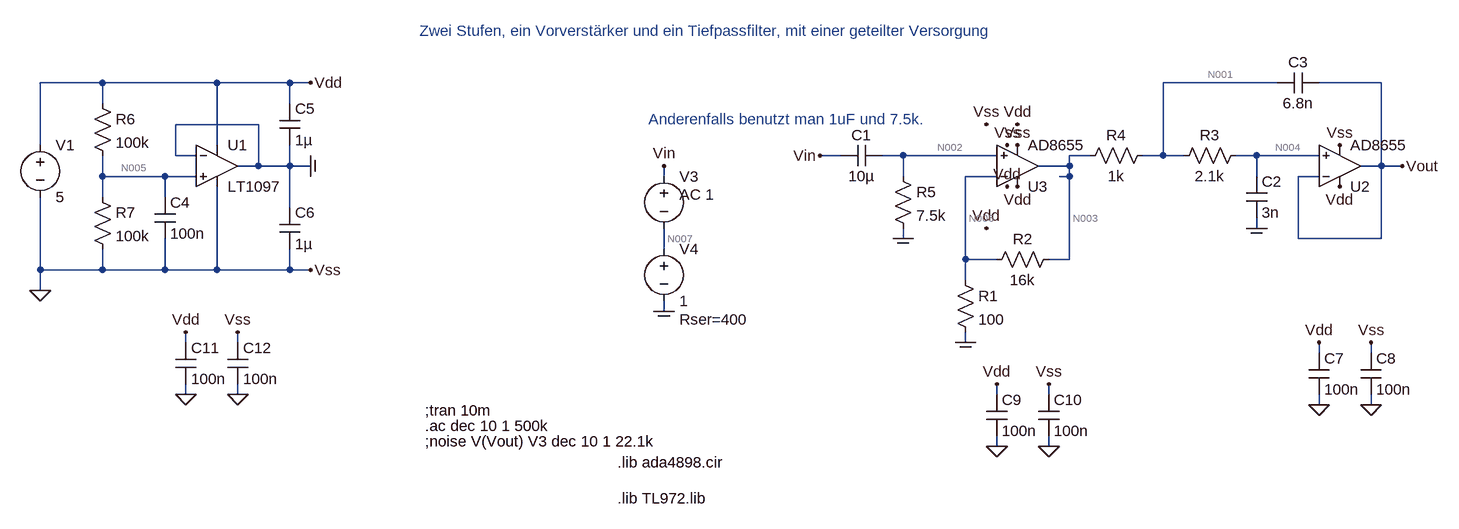
[diagram p0: schematic zwei_stufen_zweifachversorgung.asc]
zwei_stufen_zweifachversorgung.asc, the LTspice schematic file:
Version 4
SHEET 1 1124 5076
WIRE -1088 -64 -1184 -64
WIRE -912 -64 -1088 -64
WIRE -800 -64 -912 -64
WIRE -768 -64 -800 -64
WIRE 720 -64 544 -64
WIRE 880 -64 784 -64
WIRE -1088 -32 -1088 -64
WIRE -800 -32 -800 -64
WIRE -848 0 -976 0
WIRE -1184 32 -1184 -64
WIRE -912 32 -912 -64
WIRE -976 48 -976 0
WIRE -944 48 -976 48
WIRE 48 48 16 48
WIRE 144 48 112 48
WIRE 288 48 144 48
WIRE 432 48 400 48
WIRE 544 48 544 -64
WIRE 544 48 512 48
WIRE 576 48 544 48
WIRE 688 48 656 48
WIRE 784 48 688 48
WIRE -848 64 -848 0
WIRE -848 64 -880 64
WIRE -800 64 -800 32
WIRE -800 64 -848 64
WIRE -768 64 -800 64
WIRE 400 64 400 48
WIRE 400 64 352 64
WIRE 880 64 880 -64
WIRE 880 64 848 64
WIRE 912 64 880 64
WIRE -1088 80 -1088 48
WIRE -992 80 -1088 80
WIRE -944 80 -992 80
WIRE -224 80 -224 64
WIRE 144 80 144 48
WIRE 288 80 240 80
WIRE 400 80 400 64
WIRE 400 80 384 80
WIRE 688 80 688 48
WIRE 784 80 752 80
WIRE -1088 112 -1088 80
WIRE -992 112 -992 80
WIRE -800 128 -800 64
WIRE 688 160 688 144
WIRE 144 176 144 160
WIRE 752 176 752 80
WIRE 880 176 880 64
WIRE 880 176 752 176
WIRE -224 192 -224 160
WIRE 240 208 240 80
WIRE 288 208 240 208
WIRE 400 208 400 80
WIRE 400 208 368 208
WIRE -1184 224 -1184 112
WIRE -1088 224 -1088 192
WIRE -1088 224 -1184 224
WIRE -992 224 -992 176
WIRE -992 224 -1088 224
WIRE -912 224 -912 96
WIRE -912 224 -992 224
WIRE -800 224 -800 192
WIRE -800 224 -912 224
WIRE -768 224 -800 224
WIRE 240 240 240 208
WIRE -1184 256 -1184 224
WIRE -224 288 -224 272
WIRE -960 336 -960 320
WIRE -880 336 -880 320
WIRE 240 336 240 320
WIRE 784 352 784 336
WIRE 864 352 864 336
WIRE -960 416 -960 400
WIRE -880 416 -880 400
WIRE 288 416 288 400
WIRE 368 416 368 400
WIRE 784 432 784 416
WIRE 864 432 864 416
WIRE 288 496 288 480
WIRE 368 496 368 480
FLAG -768 -64 Vdd
FLAG 320 96 Vdd
FLAG 320 32 Vss
FLAG 240 336 COM
FLAG -224 288 COM
FLAG 16 48 Vin
FLAG -224 64 Vin
FLAG 816 96 Vdd
FLAG 816 32 Vss
FLAG 688 160 COM
FLAG 912 64 Vout
FLAG 144 176 COM
FLAG -768 224 Vss
FLAG -768 64 COM
FLAG -1184 256 0
FLAG 272 0 Vss
FLAG 272 160 Vdd
FLAG 320 0 Vdd
FLAG 304 32 Vss
FLAG 304 96 Vdd
FLAG 784 432 0
FLAG 864 432 0
FLAG 864 336 Vss
FLAG 784 336 Vdd
FLAG 288 496 0
FLAG 368 496 0
FLAG 368 400 Vss
FLAG 288 400 Vdd
FLAG -960 416 0
FLAG -880 416 0
FLAG -880 320 Vss
FLAG -960 320 Vdd
SYMBOL voltage -1184 16 R0
WINDOW 123 0 0 Left 0
WINDOW 39 0 0 Left 0
SYMATTR InstName V1
SYMATTR Value 5
SYMBOL res 224 224 R0
SYMATTR InstName R1
SYMATTR Value 100
SYMBOL res 384 192 R90
WINDOW 0 0 56 VBottom 2
WINDOW 3 32 56 VTop 2
SYMATTR InstName R2
SYMATTR Value 16k
SYMBOL voltage -224 64 R0
WINDOW 3 24 96 Invisible 2
WINDOW 123 24 44 Left 2
WINDOW 39 0 0 Left 0
SYMATTR Value SINE(0 10m 1k)
SYMATTR Value2 AC 1
SYMATTR InstName V3
SYMBOL voltage -224 176 R0
WINDOW 123 0 0 Left 0
WINDOW 39 24 124 Left 2
SYMATTR SpiceLine Rser=400
SYMATTR InstName V4
SYMATTR Value 1
SYMBOL cap 112 32 R90
WINDOW 0 0 32 VBottom 2
WINDOW 3 32 32 VTop 2
SYMATTR InstName C1
SYMATTR Value 10µ
SYMBOL cap 672 80 R0
SYMATTR InstName C2
SYMATTR Value 3n
SYMBOL res 672 32 R90
WINDOW 0 0 56 VBottom 2
WINDOW 3 32 56 VTop 2
SYMATTR InstName R3
SYMATTR Value 2.1k
SYMBOL res 528 32 R90
WINDOW 0 0 56 VBottom 2
WINDOW 3 32 56 VTop 2
SYMATTR InstName R4
SYMATTR Value 1k
SYMBOL cap 784 -80 R90
WINDOW 0 0 32 VBottom 2
WINDOW 3 32 32 VTop 2
SYMATTR InstName C3
SYMATTR Value 6.8n
SYMBOL res 128 64 R0
SYMATTR InstName R5
SYMATTR Value 7.5k
SYMBOL OpAmps\\LT1097 -912 0 R0
SYMATTR InstName U1
SYMBOL res -1104 -48 R0
SYMATTR InstName R6
SYMATTR Value 100k
SYMBOL res -1104 96 R0
SYMATTR InstName R7
SYMATTR Value 100k
SYMBOL cap -1008 112 R0
SYMATTR InstName C4
SYMATTR Value 100n
SYMBOL cap -816 -32 R0
SYMATTR InstName C5
SYMATTR Value 1µ
SYMBOL cap -816 128 R0
SYMATTR InstName C6
SYMATTR Value 1µ
SYMBOL OpAmps\\AD8655 320 128 M180
SYMATTR InstName U3
SYMBOL OpAmps\\AD8655 816 128 M180
SYMATTR InstName U2
SYMBOL cap 768 352 R0
SYMATTR InstName C7
SYMATTR Value 100n
SYMBOL cap 848 352 R0
SYMATTR InstName C8
SYMATTR Value 100n
SYMBOL cap 272 416 R0
SYMATTR InstName C9
SYMATTR Value 100n
SYMBOL cap 352 416 R0
SYMATTR InstName C10
SYMATTR Value 100n
SYMBOL cap -976 336 R0
SYMATTR InstName C11
SYMATTR Value 100n
SYMBOL cap -896 336 R0
SYMATTR InstName C12
SYMATTR Value 100n
TEXT -592 440 Left 2 !;tran 10m
TEXT -592 464 Left 2 !.ac dec 10 1 500k
TEXT -600 -144 Left 2 ;Zwei Stufen, ein Vorverstärker und ein Tiefpassfilter, mit einer geteilter Versorgung
TEXT -592 488 Left 2 !;noise V(Vout) V3 dec 10 1 22.1k
TEXT -296 576 Left 2 !.lib TL972.lib
TEXT -296 520 Left 2 !.lib ada4898.cir
TEXT -248 -8 Left 2 ;Anderenfalls benutzt man 1uF und 7.5k.

The netlist it stands for:
* zwei_stufen_zweifachversorgung.asc
V1 Vdd 0 5
R1 N006 COM 100
R2 N003 N006 16k
V3 Vin N007 SINE(0 10m 1k) AC 1
V4 N007 COM 1 Rser=400
C1 N002 Vin 10µ
C2 N004 COM 3n
R3 N004 N001 2.1k
R4 N001 N003 1k
C3 Vout N001 6.8n
R5 N002 COM 7.5k
XU1 N005 COM Vdd 0 COM LT1097  ; pins In+ In- V+ V- OUT
R6 Vdd N005 100k
R7 N005 0 100k
C4 N005 0 100n
C5 Vdd COM 1µ
C6 COM 0 1µ
XU3 N002 N006 Vdd 0 N003 AD8655  ; pins In+ In- V+ V- OUT
XU2 N004 Vout Vdd 0 Vout AD8655  ; pins In+ In- V+ V- OUT
C7 Vdd 0 100n
C8 0 0 100n
C9 Vdd 0 100n
C10 0 0 100n
C11 Vdd 0 100n
C12 0 0 100n
;tran 10m
.ac dec 10 1 500k
* Zwei Stufen, ein Vorverstärker und ein Tiefpassfilter, mit einer geteilter Versorgung
;noise V(Vout) V3 dec 10 1 22.1k
.lib TL972.lib
.lib ada4898.cir
* Anderenfalls benutzt man 1uF und 7.5k.
.backanno
.end

* Results of the author's LTspice run, read from the files saved beside the schematic
* Operating Point, zero values left out:
*   V(vdd) = 5 V
*   V(n006) = 2.5 V
*   V(com) = 2.5 V
*   V(n003) = 2.502 V
*   V(vin) = 3.5 V
*   V(n007) = 3.5 V
*   V(n002) = 2.5 V
*   V(n004) = 2.502 V
*   V(n001) = 2.502 V
*   V(vout) = 2.502 V
*   V(n005) = 2.5 V
*   I(R1) = 147.7 nA
*   I(R2) = 147.7 nA
*   I(R3) = 1.213 pA
*   I(R4) = 1.213 pA
*   I(R5) = -5.327 pA
*   I(R6) = 25 µA
*   I(R7) = 25 µA
*   I(V1) = -7.654 mA
*   Ix(u1:3) = 349.8 µA
*   Ix(u1:4) = -349.9 µA
*   Ix(u1:5) = 147.7 nA
*   Ix(u3:3) = 3.64 mA
*   Ix(u3:4) = -3.64 mA
*   Ix(u3:5) = -147.7 nA
*   Ix(u2:3) = 3.64 mA
*   Ix(u2:4) = -3.64 mA
*   Ix(u2:5) = -28.07 pA
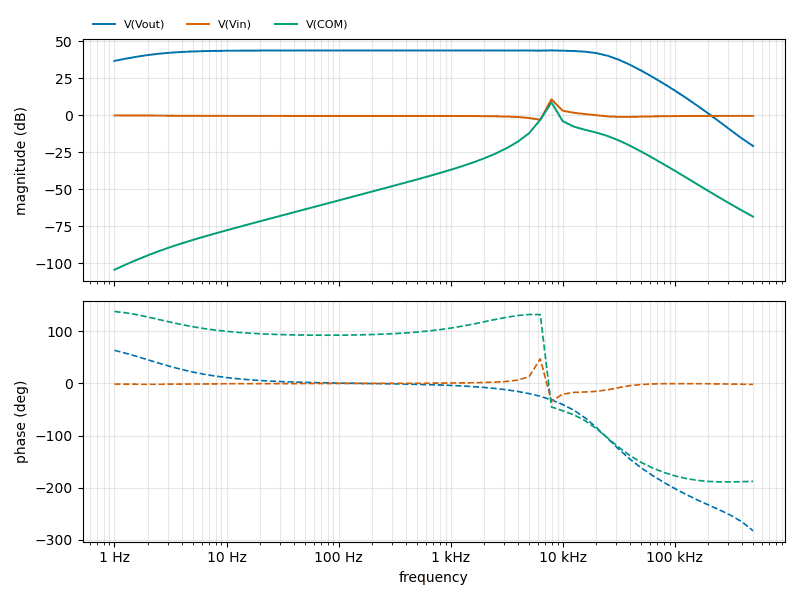
[diagram p1: AC Analysis of zwei_stufen_zweifachversorgung.asc, plotted from the saved traces]
* AC Analysis, 1 run:
*   V(Vout): 36.64 dB at 1 Hz, -20.75 dB at 500 kHz, peak 43.74 dB at 7.943 kHz, 3 dB below the peak at 2.05 Hz and 23.31 kHz
*   V(Vin): -0.09 dB at 1 Hz, -0.44 dB at 500 kHz, peak 10.76 dB at 7.943 kHz, 3 dB below the peak at 7.553 kHz and 8.694 kHz
*   V(COM): -104.19 dB at 1 Hz, -68.41 dB at 500 kHz, peak 8.68 dB at 7.943 kHz, 3 dB below the peak at 7.489 kHz and 8.391 kHz